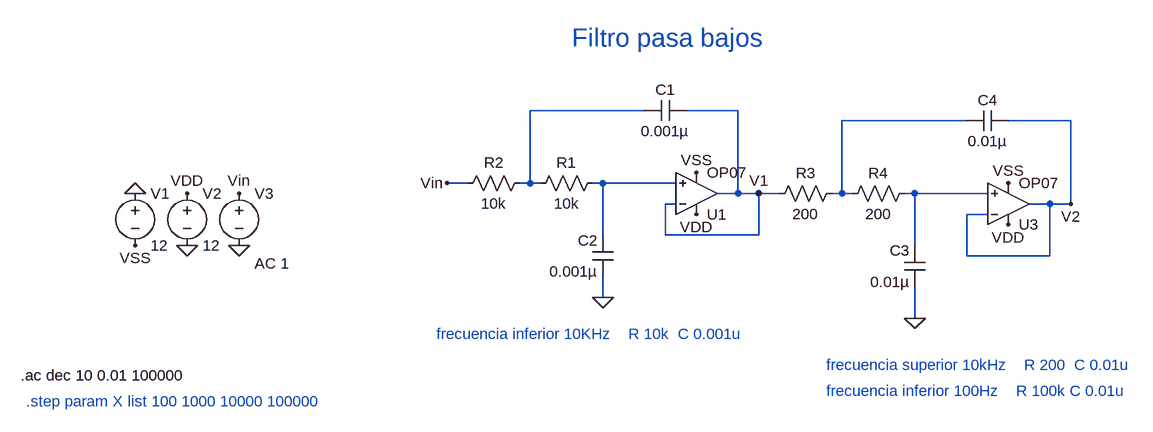
[diagram p0: schematic lpf.asc]
lpf.asc, the LTspice schematic file:
Version 4
SHEET 1 1484 680
WIRE 144 16 -32 16
WIRE 288 16 208 16
WIRE 640 32 448 32
WIRE 800 32 704 32
WIRE -128 128 -160 128
WIRE -32 128 -32 16
WIRE -32 128 -48 128
WIRE -16 128 -32 128
WIRE 80 128 64 128
WIRE 192 128 80 128
WIRE 288 144 288 16
WIRE 288 144 256 144
WIRE 320 144 288 144
WIRE 352 144 320 144
WIRE 448 144 448 32
WIRE 448 144 432 144
WIRE 464 144 448 144
WIRE 560 144 544 144
WIRE 672 144 560 144
WIRE 192 160 176 160
WIRE 768 160 736 160
WIRE 800 160 800 32
WIRE 800 160 768 160
WIRE 672 176 640 176
WIRE 80 208 80 128
WIRE 176 208 176 160
WIRE 320 208 320 144
WIRE 320 208 176 208
WIRE 560 224 560 144
WIRE 640 240 640 176
WIRE 768 240 768 160
WIRE 768 240 640 240
WIRE 80 304 80 272
WIRE 560 336 560 288
FLAG 80 304 0
FLAG 560 336 0
FLAG 224 176 VDD
FLAG 704 192 VDD
FLAG 224 112 VSS
FLAG 704 128 VSS
FLAG -640 144 0
FLAG -560 224 0
FLAG -480 224 0
FLAG -560 144 VDD
FLAG -640 224 VSS
FLAG -480 144 Vin
FLAG -160 128 Vin
FLAG 800 160 V2
FLAG 320 144 V1
SYMBOL Opamps\\OP07 224 208 M180
SYMATTR InstName U1
SYMBOL cap 208 0 R90
WINDOW 0 0 32 VBottom 2
WINDOW 3 32 32 VTop 2
SYMATTR InstName C1
SYMATTR Value 0.001µ
SYMBOL cap 96 272 R180
WINDOW 0 24 56 Left 2
WINDOW 3 24 8 Left 2
SYMATTR InstName C2
SYMATTR Value 0.001µ
SYMBOL res 80 112 R90
WINDOW 0 0 56 VBottom 2
WINDOW 3 32 56 VTop 2
SYMATTR InstName R1
SYMATTR Value 10k
SYMBOL res -32 112 R90
WINDOW 0 0 56 VBottom 2
WINDOW 3 32 56 VTop 2
SYMATTR InstName R2
SYMATTR Value 10k
SYMBOL Opamps\\OP07 704 224 M180
SYMATTR InstName U3
SYMBOL cap 576 288 R180
WINDOW 0 24 56 Left 2
WINDOW 3 24 8 Left 2
SYMATTR InstName C3
SYMATTR Value 0.01µ
SYMBOL cap 704 16 R90
WINDOW 0 0 32 VBottom 2
WINDOW 3 32 32 VTop 2
SYMATTR InstName C4
SYMATTR Value 0.01µ
SYMBOL res 448 128 R90
WINDOW 0 0 56 VBottom 2
WINDOW 3 32 56 VTop 2
SYMATTR InstName R3
SYMATTR Value 200
SYMBOL res 560 128 R90
WINDOW 0 0 56 VBottom 2
WINDOW 3 32 56 VTop 2
SYMATTR InstName R4
SYMATTR Value 200
SYMBOL voltage -640 128 R0
WINDOW 123 0 0 Left 2
WINDOW 39 0 0 Left 2
SYMATTR InstName V1
SYMATTR Value 12
SYMBOL voltage -560 128 R0
WINDOW 123 0 0 Left 2
WINDOW 39 0 0 Left 2
SYMATTR InstName V2
SYMATTR Value 12
SYMBOL voltage -480 128 R0
WINDOW 123 24 124 Left 2
WINDOW 39 0 0 Left 2
SYMATTR Value2 AC 1
SYMATTR InstName V3
SYMATTR Value ""
TEXT -816 424 Left 2 !.ac dec 10 0.01 100000
TEXT -808 464 Left 2 ;.step param X list 100 1000 10000 100000
TEXT -176 360 Left 2 ;frecuencia inferior 10KHz    R 10k  C 0.001u
TEXT 424 408 Left 2 ;frecuencia superior 10kHz    R 200  C 0.01u
TEXT 424 448 Left 2 ;frecuencia inferior 100Hz    R 100k C 0.01u
TEXT 32 -96 Left 4 ;Filtro pasa bajos

The netlist it stands for:
* lpf.asc
XU1 N003 V1 VDD VSS V1 LT1001  ; OP07, pins In+ In- V+ V- OUT
C1 V1 N001 0.001µ
C2 0 N003 0.001µ
R1 N003 N001 10k
R2 N001 Vin 10k
XU3 N004 V2 VDD VSS V2 LT1001  ; OP07, pins In+ In- V+ V- OUT
C3 0 N004 0.01µ
C4 V2 N002 0.01µ
R3 N002 V1 200
R4 N004 N002 200
V1 0 VSS 12
V2 VDD 0 12
V3 Vin 0 AC 1
.ac dec 10 0.01 100000
* .step param X list 100 1000 10000 100000
* frecuencia inferior 10KHz    R 10k  C 0.001u
* frecuencia superior 10kHz    R 200  C 0.01u
* frecuencia inferior 100Hz    R 100k C 0.01u
* Filtro pasa bajos
.lib LTC.lib
.backanno
.end

* Results of the author's LTspice run, read from the files saved beside the schematic
* Operating Point, zero values left out:
*   V(vdd) = 12 V
*   V(vss) = -12 V
*   I(V2) = -4.5 mA
*   I(V1) = -4.5 mA
*   Ix(u1:3) = 2.25 mA
*   Ix(u1:4) = -2.25 mA
*   Ix(u3:3) = 2.25 mA
*   Ix(u3:4) = -2.25 mA
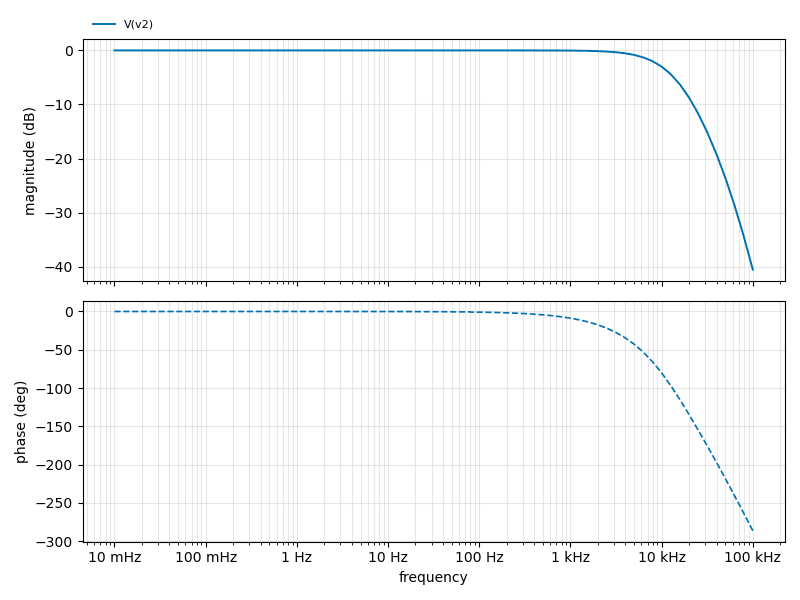
[diagram p1: AC Analysis of lpf.asc, plotted from the saved traces]
* AC Analysis, 1 run:
*   V(v2): -0.00 dB at 10 mHz, -40.55 dB at 100 kHz, peak -0.00 dB at 10 mHz, 3 dB below the peak at 10.02 kHz